# Altium schematic sheet sheet2.SchDoc
size A2
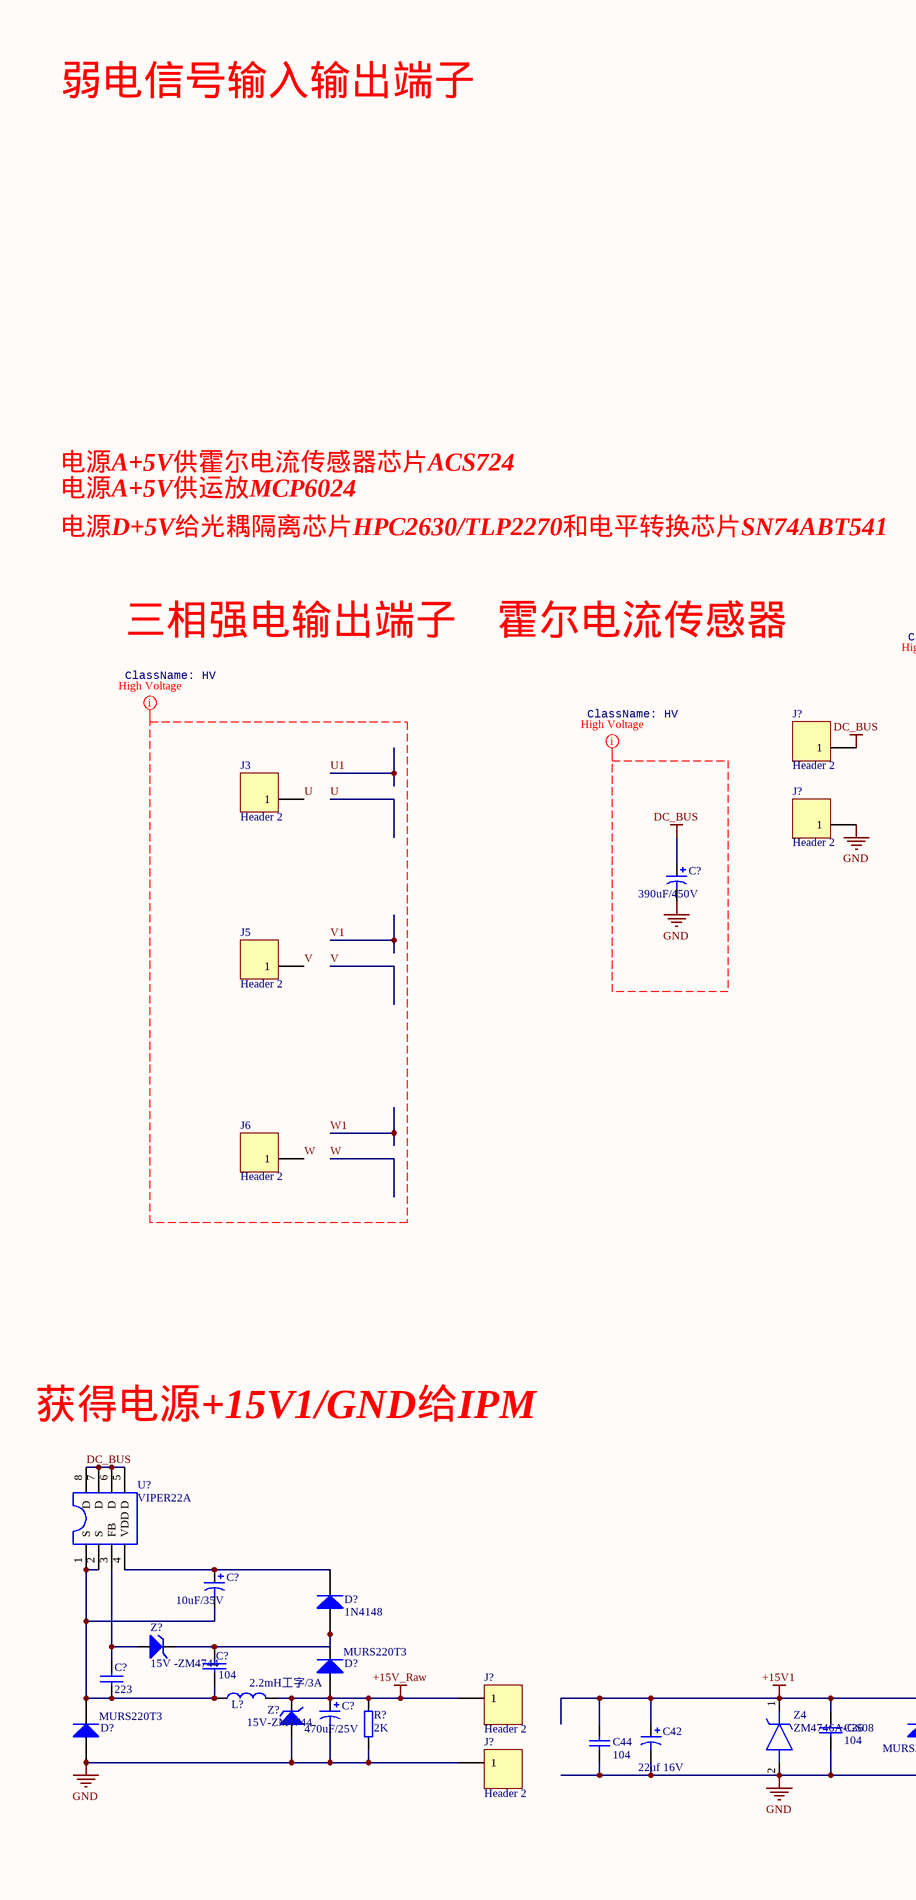
[diagram p0: sheet2.SchDoc, left]
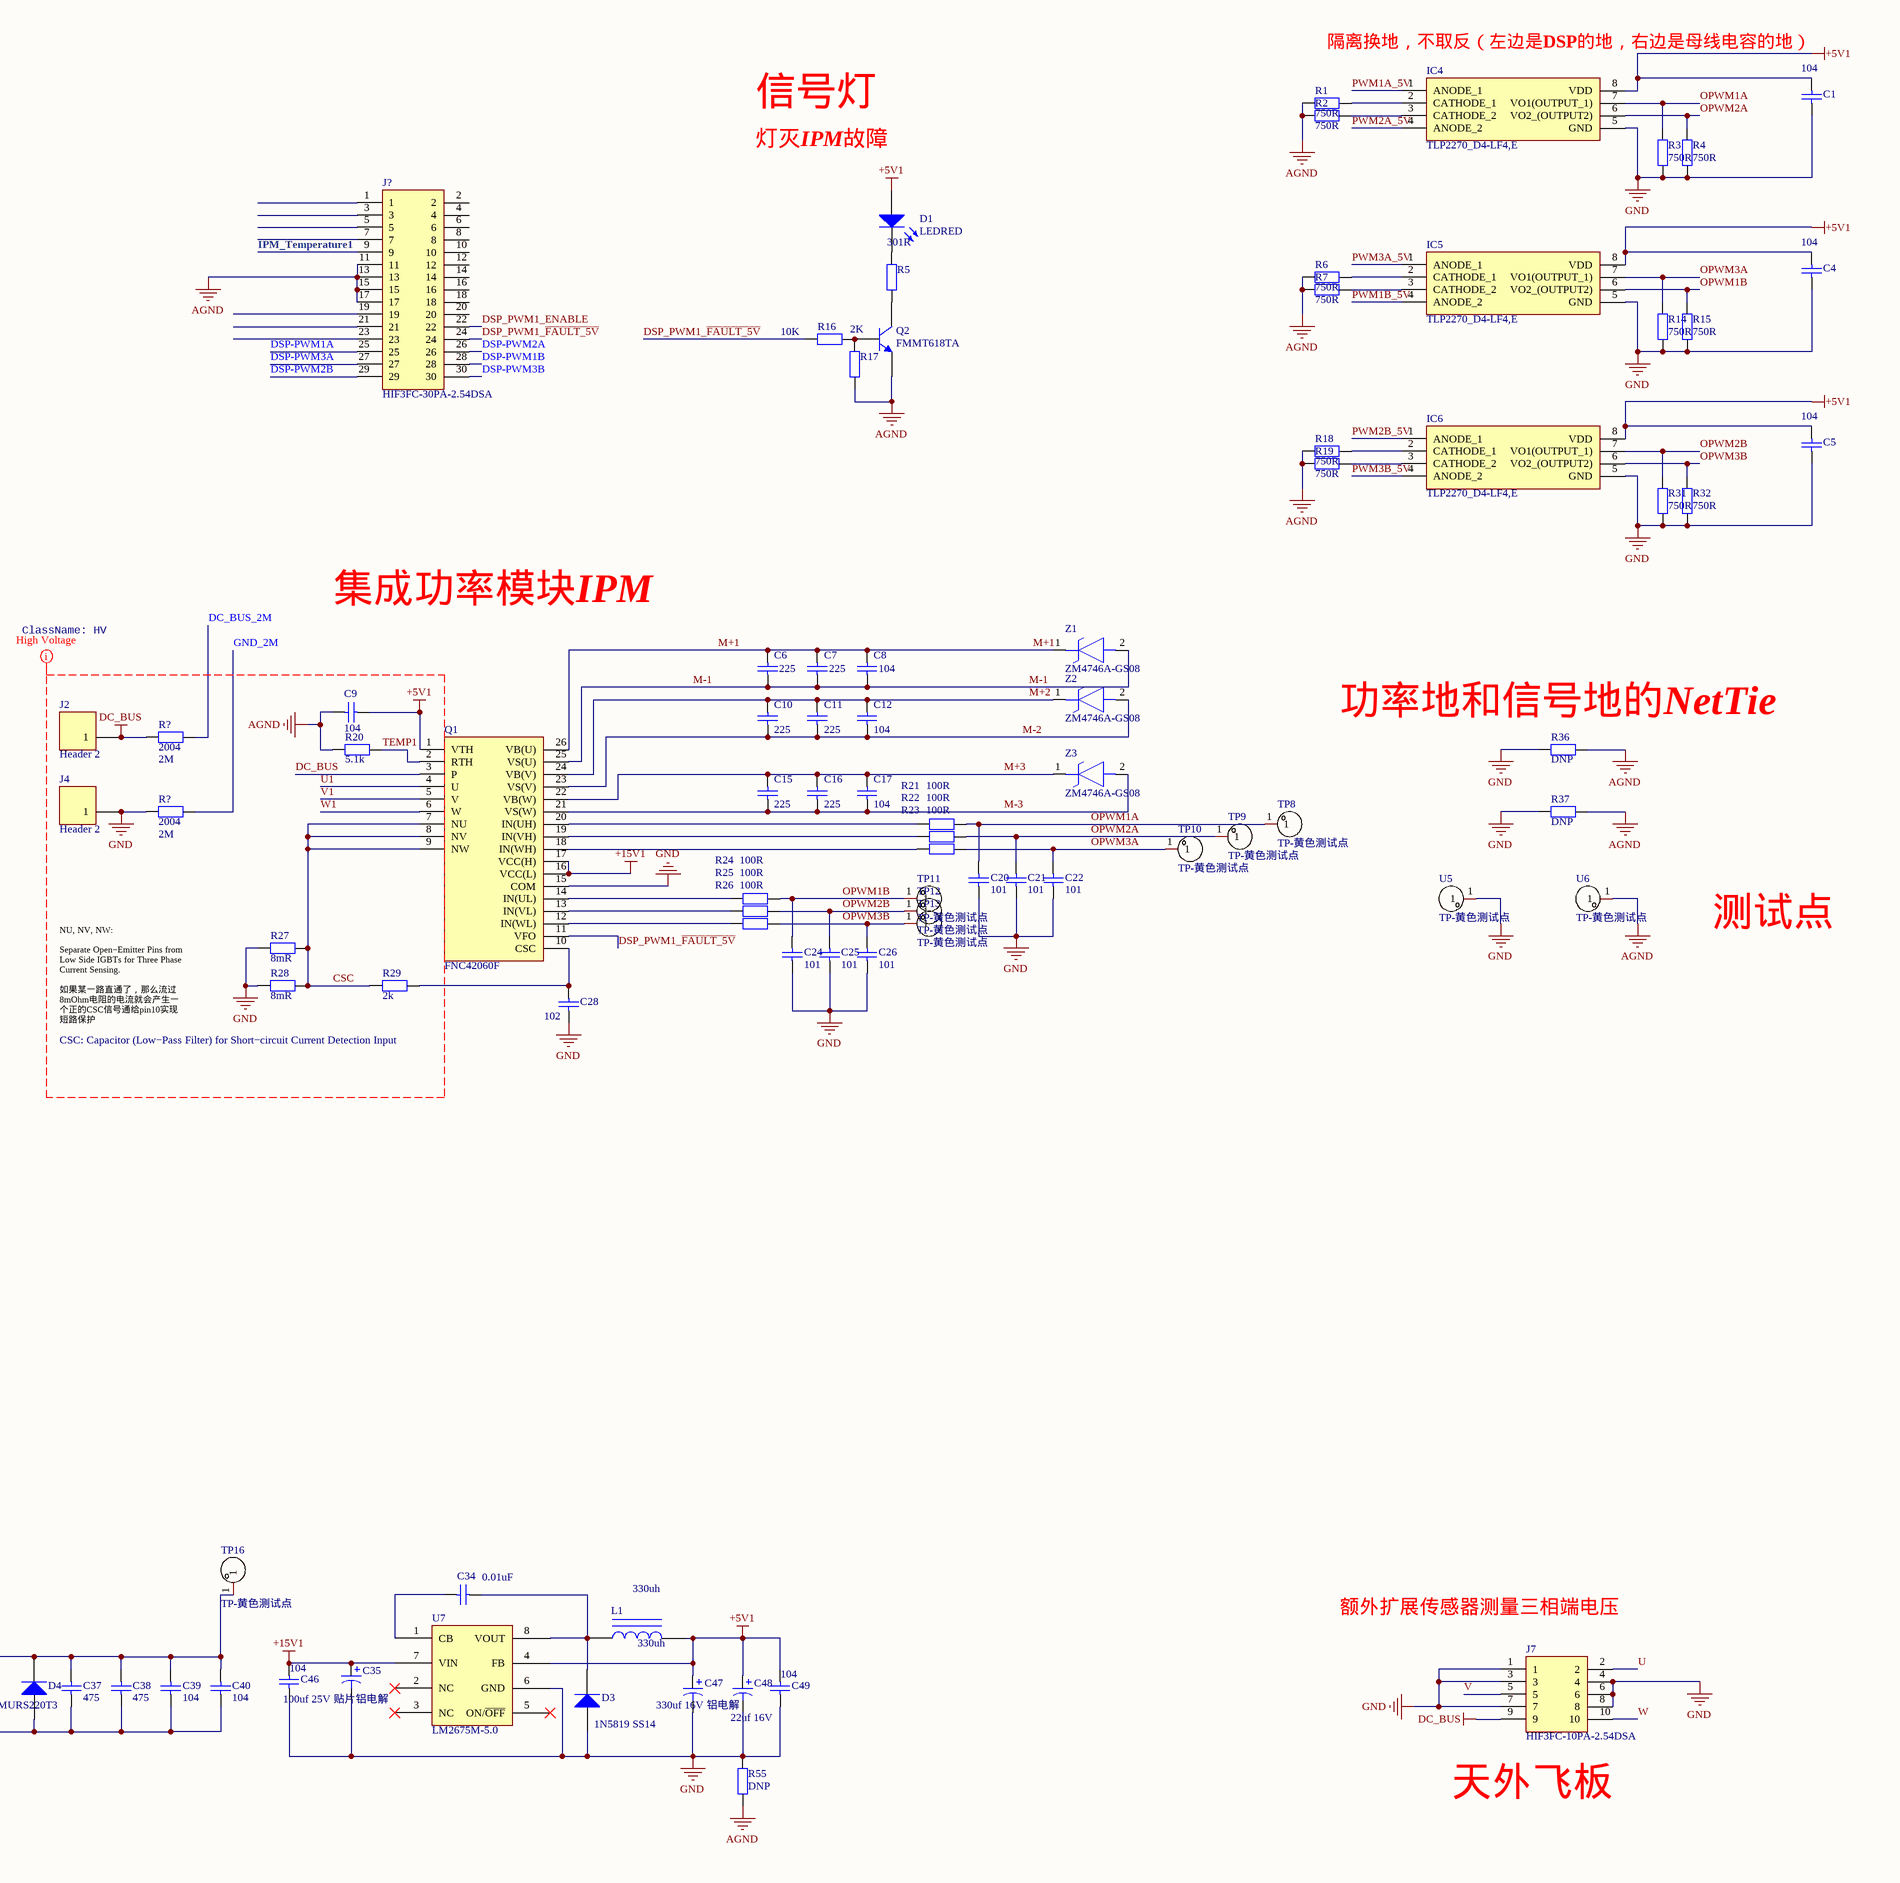
[diagram p1: sheet2.SchDoc, right]

## Parts
(Parts that share a designator on the sheet are numbered #1, #2 ... from top to bottom, then left to right.)
C1  104  [0805]
C4  104  [0805]
C5  104  [0805]
C6  225  [0805]
C7  225  [0805]
C8  104  [0805]
C9  104  [0805]
C10  225  [0805]
C11  225  [0805]
C12  104  [0805]
C15  225  [0805]
C16  225  [0805]
C17  104  [0805]
C20  101  [0805]
C21  101  [0805]
C22  101  [0805]
C24  101  [0805]
C25  101  [0805]
C26  101  [0805]
C28  102  [0805]
C34  0.01uF  [0805]
C35  100uf 25V 贴片铝电解  [CAP/6.4mm -]
C36  104  [0805]
C37  475  [0805]
C38  475  [0805]
C39  104  [0805]
C40  104  [0805]
C42  22uf 16V  [1206 (钽电容)]
C44  104  [0805]
C46  104  [0805]
C47  330uf 16V 铝电解  [CAP/8mm]
C48  22uf 16V  [1206 (钽电容)]
C49  104  [0805]
C?#1  390uF/450V  [CAP/30mm]
C?#2  10uF/35V  [CAP/6.4mm -]
C?#3  104  [0805]
C?#4  223  [0805]
C?#5  470uF/25V  [CAP/8mm]
D1  LEDRED  [L0805]
D3  1N5819 SS14  [DO214AC]
D4  MURS220T3  [DO214AA]
D?#1  1N4148  [LL4148]
D?#2  MURS220T3  [DO214AA]
D?#3  MURS220T3  [DO214AA]
IC4  TLP2270_D4-LF4,E  [SOIC127P1105X220-8N]
IC5  TLP2270_D4-LF4,E  [SOIC127P1105X220-8N]
IC6  TLP2270_D4-LF4,E  [SOIC127P1105X220-8N]
J2  Header 2  [PCB焊接端子]
J3  Header 2  [PCB焊接端子]
J4  Header 2  [PCB焊接端子]
J5  Header 2  [PCB焊接端子]
J6  Header 2  [PCB焊接端子]
J7  HIF3FC-10PA-2.54DSA  [SHDR10W50P254_2X5_2020X850X920P]
J?#1  HIF3FC-30PA-2.54DSA  [SHDR30W50P254_2X15_4560X850X1200P]
J?#2  Header 2  [PCB焊接端子]
J?#3  Header 2  [PCB焊接端子]
J?#4  Header 2  [PCB焊接端子]
J?#5  Header 2  [PCB焊接端子]
L1  330uh  [L_7*7]
L?  2.2mH工字/3A  [L\5\10]
Q1  FNC42060F  [FNC42060F]
Q2  FMMT618TA  [SOT-23]
R1  750R  [0805]
R2  750R  [0805]
R3  750R  [0805]
R4  750R  [0805]
R5  301R  [0805]
R6  750R  [0805]
R7  750R  [0805]
R14  750R  [0805]
R15  750R  [0805]
R16  10K  [0805]
R17  2K  [0805]
R18  750R  [0805]
R19  750R  [0805]
R20  5.1k  [0805]
R21  100R  [0805]
R22  100R  [0805]
R23  100R  [0805]
R24  100R  [0805]
R25  100R  [0805]
R26  100R  [0805]
R27  8mR  [2512]
R28  8mR  [2512]
R29  2k  [0805]
R31  750R  [0805]
R32  750R  [0805]
R36  DNP  [0805]
R37  DNP  [0805]
R55  DNP  [2512]
R?#1  2004  value 2M  [1206]
R?#2  2004  value 2M  [1206]
R?#3  2K  [1206]
TP8  TP-黄色测试点  [TESTPOINT-TH_BD1.0]
TP9  TP-黄色测试点  [TESTPOINT-TH_BD1.0]
TP10  TP-黄色测试点  [TESTPOINT-TH_BD1.0]
TP11  TP-黄色测试点  [TESTPOINT-TH_BD1.0]
TP12  TP-黄色测试点  [TESTPOINT-TH_BD1.0]
TP13  TP-黄色测试点  [TESTPOINT-TH_BD1.0]
TP16  TP-黄色测试点  [TESTPOINT-TH_BD1.0]
U5  TP-黄色测试点  [TESTPOINT-TH_BD1.0]
U6  TP-黄色测试点  [TESTPOINT-TH_BD1.0]
U7  LM2675M-5.0  [SOIC-8]
U?  VIPER22A  [DIP8]
Z1  ZM4746A-GS08  [MELF_DO-213AB]
Z2  ZM4746A-GS08  [MELF_DO-213AB]
Z3  ZM4746A-GS08  [MELF_DO-213AB]
Z4  ZM4746A-GS08  [MELF_DO-213AB]
Z?#1  15V -ZM4744  [LL4148]
Z?#2  15V-ZM4744  [LL4148]

## Nets
+5V1: C1.2 C4.2 C5.2 C9.2 C47.1 C48.1 C49.2 D1.1(A) IC4.8(VDD) IC5.8(VDD) IC6.8(VDD) L1.2 Q1.1(VTH) U7.4(FB)
+15V1: C35.1 C36.1 C37.2 C38.2 C39.2 C40.2 C42.1 C44.1 C46.2 D4.2(K) Q1.16(VCC(L)) Q1.17(VCC(H)) TP16.1 U7.7(VIN) Z4.1(K)
+15V_Raw: C?#5.1 D?#2.1(A) J?#4.1 L?.2 R?#3.1 Z?#2.2(K)
AGND: C9.1 J?#1.11 J?#1.13 J?#1.15 J?#1.17 Q2.2(E) R1.2 R2.2 R6.2 R7.2 R17.2 R18.2 R19.2 R20.1 R36.2 R37.2 R55.1 U6.1
DC_BUS: C?#1.1 J2.1 J7.9 J?#2.1 Q1.3(P) R?#1.1 U?.5(D) U?.6(D) U?.7(D) U?.8(D)
GND: C1.1 C4.1 C5.1 C20.1 C21.1 C22.1 C24.1 C25.1 C26.1 C28.1 C35.2 C36.2 C37.1 C38.1 C39.1 C40.1 C42.2 C44.2 C46.1 C47.2 C48.2 C49.1 C?#1.2 C?#5.2 D3.1 D4.1(A) D?#3.1(A) IC4.5(GND) IC5.5(GND) IC6.5(GND) J4.1 J7.1 J7.3 J7.4 J7.6 J7.7 J7.8 J?#3.1 J?#5.1 Q1.15(COM) R3.2 R4.2 R14.2 R15.2 R27.2 R28.2 R31.2 R32.2 R36.1 R37.1 R55.2 R?#2.1 R?#3.2 U5.1 U7.6(GND) Z4.2(A) Z?#2.1(A)
CSC: Q1.7(NU) Q1.8(NV) Q1.9(NW) R27.1 R28.1 R29.2
DC_BUS_2M: R?#1.2
DSP-PWM1A: J?#1.25
DSP-PWM1B: J?#1.28
DSP-PWM2A: J?#1.26
DSP-PWM2B: J?#1.29
DSP-PWM3A: J?#1.27
DSP-PWM3B: J?#1.30
DSP_PWM1_ENABLE: J?#1.22
DSP_PWM1_~{FAULT_5V}: J?#1.24 Q1.11(VFO) R16.2
GND_2M: R?#2.2
IPM_Temperature1: J?#1.9
M+1: C6.1 C7.1 C8.1 Q1.26(VB(U)) Z1.1(K)
M+2: C10.1 C11.1 C12.1 Q1.24(VB(V)) Z2.1(K)
M+3: C15.1 C16.1 C17.1 Q1.22(VB(W)) Z3.1(K)
M-1: C6.2 C7.2 C8.2 Q1.25(VS(U)) Z1.2(A)
M-2: C10.2 C11.2 C12.2 Q1.23(VS(V)) Z2.2(A)
M-3: C15.2 C16.2 C17.2 Q1.21(VS(W)) Z3.2(A)
OPWM1A: C20.2 IC4.7(VO1(OUTPUT_1)) R3.1 R21.2 TP8.1
OPWM1B: C24.2 IC5.6(VO2_(OUTPUT2)) R15.1 R24.2 TP11.1
OPWM2A: C21.2 IC4.6(VO2_(OUTPUT2)) R4.1 R22.2 TP9.1
OPWM2B: C25.2 IC6.7(VO1(OUTPUT_1)) R25.2 R31.1 TP12.1
OPWM3A: C22.2 IC5.7(VO1(OUTPUT_1)) R14.1 R23.2 TP10.1
OPWM3B: C26.2 IC6.6(VO2_(OUTPUT2)) R26.2 R32.1 TP13.1
PWM1A_5V: IC4.1(ANODE_1)
PWM1B_5V: IC5.4(ANODE_2)
PWM2A_5V: IC4.4(ANODE_2)
PWM2B_5V: IC6.1(ANODE_1)
PWM3A_5V: IC5.1(ANODE_1)
PWM3B_5V: IC6.4(ANODE_2)
TEMP1: Q1.2(RTH) R20.2
U: J3.1 J7.2
U1: Q1.4(U)
V: J5.1 J7.5
V1: Q1.5(V)
W: J6.1 J7.10
W1: Q1.6(W)
NetC28_2: C28.2 Q1.10(CSC) R29.1
NetC34_1: C34.1 D3.2 L1.1 U7.8(VOUT)
NetC34_2: C34.2 U7.1(CB)
NetC?#2_1: C?#2.1 D?#1.2(K) U?.4(VDD)
NetC?#2_2: C?#2.2 C?#3.1 C?#4.1 D?#3.2(K) L?.1 U?.1(S) U?.2(S)
NetC?#3_2: C?#3.2 D?#1.1(A) D?#2.2(K) Z?#1.2(K)
NetC?#4_2: C?#4.2 U?.3(FB) Z?#1.1(A)
NetD1_2: D1.2(K) R5.2
NetIC4_2: IC4.2(CATHODE_1) R1.1
NetIC4_3: IC4.3(CATHODE_2) R2.1
NetIC5_2: IC5.2(CATHODE_1) R6.1
NetIC5_3: IC5.3(CATHODE_2) R7.1
NetIC6_2: IC6.2(CATHODE_1) R18.1
NetIC6_3: IC6.3(CATHODE_2) R19.1
NetQ1_12: Q1.12(IN(WL)) R26.1
NetQ1_13: Q1.13(IN(VL)) R25.1
NetQ1_14: Q1.14(IN(UL)) R24.1
NetQ1_18: Q1.18(IN(WH)) R23.1
NetQ1_19: Q1.19(IN(VH)) R22.1
NetQ1_20: Q1.20(IN(UH)) R21.1
NetQ2_1: Q2.1(B) R16.1 R17.1
NetQ2_3: Q2.3(C) R5.1

Not connected (* = marked no-connect by the designer): J?#1 1 2 3 4 5 6 7 8 10 12 14 16 18 19 20 21 23; U7 2(NC)* 3(NC)* 5(ON/~{OFF})*

## Layout directives
net class HV: +5V1, AGND, CSC, DC_BUS, GND, TEMP1, U, U1, V, V1, W, W1

## Notes on the sheet
- 隔离换地，不取反（左边是DSP的地，右边是母线电容的地）
- 弱电信号输入输出端子
- 灯灭IPM故障
- 信号灯
- 电源A+5V供霍尔电流传感器芯片ACS724
- 电源A+5V供运放MCP6024
- 电源D+5V给光耦隔离芯片HPC2630/TLP2270和电平转换芯片SN74ABT541
- 三相强电输出端子
- 霍尔电流传感器
- 集成功率模块IPM
- (near R36) 功率地和信号地的NetTie
- 测试点
- NU, NV, NW:
  Separate Open−Emitter Pins from Low Side IGBTs for Three Phase Current Sensing.
  如果某一路直通了，那么流过8mOhm电阻的电流就会产生一个正的CSC信号通给pin10实现短路保护
- CSC: Capacitor (Low−Pass Filter) for Short−circuit Current Detection Input
- 获得电源+15V1/GND给IPM
- 额外扩展传感器测量三相端电压
- (near J7) 天外飞板

## Library data of the parts
C1 C4-C12 C15-C17 C20-C22 C24-C26 C28 C34 C37-C40 = Cap: Capacitor
  C1 C4 C5: Published: 8-Jun-2000; Revision: July-2002: Re-released for DXP Platform.; Publisher: Altium Limited
  C6-C12 C15-C17 C20-C22 C24-C26 C28 C37-C40: Published: *; LatestRevisionDate: *; LatestRevisionNote: *; PackageReference: *; Publisher: *
  C34: Published: 8-Jun-2000; Revision: July-2002: Re-released for DXP Platform.; Publisher: Altium Limited; Value: 0.01uF
C35 C42 C47 C48 C?#1 C?#2 C?#5 = Cap Pol1: Polarized Capacitor (Radial); Published: 8-Jun-2000; LatestRevisionDate: 17-Jul-2002; LatestRevisionNote: Re-released for DXP Platform.; Publisher: Altium Limited
C36 C?#3 C?#4 = CAP: Capacitor
C44 = Cap: Capacitor; Value: 0.1UF; Published: 8-Jun-2000; LatestRevisionDate: 17-Jul-2002; LatestRevisionNote: Re-released for DXP Platform.; PackageReference: RAD-0.3; Publisher: Altium Limited
C46 C49 = Cap Semi: Capacitor (Semiconductor SIM Model); Published: 8-Jun-2000; LatestRevisionDate: 17-Jul-2002; LatestRevisionNote: Re-released for DXP Platform.; PackageReference: C1206; Publisher: Altium Limited
D1 = LED0: Typical INFRARED GaAs LED; Published: 8-Jun-2000; LatestRevisionDate: 08-Jul-2005; LatestRevisionNote: Mech Layer 1 removed.; PackageReference: LED-0; Publisher: Altium Limited; PackageDescription: LED; 2 Leads; ClassName: HelloDSP
D3 D4 D?#2 D?#3 = Diode 1N5408: 3 Amp Medium Power Silicon Rectifier Diode; Published: 8-Jun-2000; LatestRevisionDate: 17-Jul-2002; LatestRevisionNote: Re-released for DXP Platform.; DatasheetDocument: Aug-1984; PackageReference: DO-201AD; Publisher: Altium Limited; ComponentLink1Description: Manufacturer Link; ComponentLink1URL: http://www.irf.com/
D?#1 = Diode 1N4148: High Conductance Fast Diode; Published: 8-Jun-2000; LatestRevisionDate: 17-Jul-2002; LatestRevisionNote: Re-released for DXP Platform.; DatasheetDocument: 1997; PackageReference: DO-35; Publisher: Altium Limited; Code_JEDEC: DO-204-AH; ComponentLink1Description: Manufacturer Link; ComponentLink1URL: http://www.fairchildsemi.com/; ComponentLink2Description: Datasheet; ComponentLink2URL: http://www.fairchildsemi.com/ds/1N%2F1N4148.pdf
IC4-IC6 = TLP2270_D4-LF4,E: Integrated Circuit; Manufacturer_Name: Toshiba; Manufacturer_Part_Number: TLP2270(D4-LF4,E; Datasheet Link: http://toshiba.semicon-storage.com/info/docget.jsp?did=54624&prodName=TLP2270; Height: 2.2mm; Mouser Part Number: 757-TLP2270D4-LF4E; Mouser Price/Stock: https://www.mouser.co.uk/ProductDetail/Toshiba/TLP2270D4-LF4E?qs=byeeYqUIh0MHPEM80CcHUQ%3D%3D; Arrow Part Number: TLP2270(D4-LF4,E; Arrow Price/Stock: https://www.arrow.com/en/products/tlp2270-d4-lf4e/toshiba
J2-J6 J?#2-J?#5 = Header 2: Header, 2-Pin; LatestRevisionDate: 17-Jul-2002; LatestRevisionNote: Re-released for DXP Platform.; Publisher: Altium Limited
J7 = HIF3FC-10PA-2.54DSA: Connector; Manufacturer_Name: Hirose; Manufacturer_Part_Number: HIF3FC-10PA-2.54DSA(71); Datasheet Link: https://componentsearchengine.com/Datasheets/1/HIF3FC-10PA-2.54DSA(71).pdf; Height: 9.2mm; Mouser Part Number: 798-HIF3FC10PA254D71; Mouser Price/Stock: https://www.mouser.co.uk/ProductDetail/Hirose-Connector/HIF3FC-10PA-2.54DSA71?qs=eDUdFcBPps26f2LJxn%252B8VA%3D%3D; System: Connector
J?#1 = HIF3FC-30PA-2.54DSA: Connector; Manufacturer_Name: Hirose; Manufacturer_Part_Number: HIF3FC-30PA-2.54DSA(71); Datasheet Link: https://datasheet.datasheetarchive.com/originals/distributors/SFDatasheet-7/sf-000141320.pdf; Height: 12mm; Mouser Part Number: 798-HIF3FC30PA254D71; Mouser Price/Stock: https://www.mouser.co.uk/ProductDetail/Hirose-Connector/HIF3FC-30PA-254DSA71?qs=eDUdFcBPps32%2FyAdBVx6ww%3D%3D; System: Connector
L1 = Inductor Iron: Magnetic-Core Inductor; Published: 24-Mar-1999; LatestRevisionDate: 17-Jul-2002; LatestRevisionNote: Re-released for DXP Platform.; PackageReference: AXIAL-0.9; Publisher: Altium Limited; Value: 330uh
L? = INDUCTOR1: INDUCTOR
Q1 = FNC42060F: Transistor IGBT; Manufacturer_Name: Aptina / ON Semiconductor; Datasheet Link: https://www.onsemi.com/pdf/datasheet/fnc42060f2-d.pdf; Height: 4.8mm; Manufacturer_Part_Number: FNC42060F; Mouser Part Number: 512-FNC42060F; Mouser Price/Stock: https://www.mouser.co.uk/ProductDetail/onsemi-Fairchild/FNC42060F?qs=udYk%2FVsBYxunyypMBLcvag%3D%3D
Q2 = NPN: NPN Bipolar Transistor; Published: 8-Jun-2000; LatestRevisionDate: 17-Jul-2002; LatestRevisionNote: Re-released for DXP Platform.; PackageReference: TO-226-AA; Publisher: Altium Limited; PackageDescription: TO, Flat Index; 3 In-Line, Axial Leads; Body Dia. 4.8mm; Leads 0.55 x 0.51 mm (max); Code_JEDEC: TO-226-AA; ClassName: HelloDSP
R1-R4 R6 R7 R14-R26 R29 R31 R32 R36 R37 R55 R?#1 R?#2 = Res2: Resistor
  R1-R4 R6 R7 R14 R15 R18 R19 R31 R32: Published: 8-Jun-2000; LatestRevisionDate: 17-Jul-2002; LatestRevisionNote: Re-released for DXP Platform.; Publisher: Altium Limited
  R16: Published: 8-Jun-2000; LatestRevisionDate: 17-Jul-2002; LatestRevisionNote: Re-released for DXP Platform.; PackageReference: AXIAL-0.4; Publisher: Altium Limited; Value: 10K; ClassName: HelloDSP
  R17: Published: 8-Jun-2000; LatestRevisionDate: 17-Jul-2002; LatestRevisionNote: Re-released for DXP Platform.; PackageReference: AXIAL-0.4; Publisher: Altium Limited; Value: 2K; ClassName: HelloDSP
  R20 R29 R36 R37 R?#1 R?#2: Published: 8-Jun-2000; LatestRevisionDate: 17-Jul-2002; LatestRevisionNote: Re-released for DXP Platform.; PackageReference: AXIAL-0.4; Publisher: Altium Limited
  R21-R26: Published: *; LatestRevisionDate: *; LatestRevisionNote: *; PackageReference: *; Publisher: *
  R55: Published: 8-Jun-2000; LatestRevisionDate: 17-Jul-2002; LatestRevisionNote: Re-released for DXP Platform.; PackageReference: AXIAL-0.4; Publisher: Altium Limited; ClassName: Power
R5 = Res2: Resistor; Value: 300R; Published: 8-Jun-2000; LatestRevisionDate: 17-Jul-2002; LatestRevisionNote: Re-released for DXP Platform.; PackageReference: AXIAL-0.4; Publisher: Altium Limited; ClassName: HelloDSP
R27 R28 = Res2: Resistor; Value: 3.3K; Published: 8-Jun-2000; LatestRevisionDate: 17-Jul-2002; LatestRevisionNote: Re-released for DXP Platform.; PackageReference: AXIAL-0.4; Publisher: Altium Limited; PackageDescription: Axial Device, Thru-Hole; 2 Leads; 0.4 in Pin Spacing
R?#3 = RES
TP8-TP13 TP16 U5 U6 = TP-黄色测试点: Add into BOM: yes; Name: TP-黄色测试点; Symbol: TP-黄色测试点; Device: TP-黄色测试点; LCSC Part Name: TP-黄色测试点; Supplier Part: C9900007422; Manufacturer Part: TP-黄色测试点; Supplier Footprint: TESTPOINT-TH_BD-2P-P2.00; JLCPCB Part Class: Extended Part; Datasheet: https://atta.szlcsc.comnull; Supplier: LCSC; Convert to PCB: yes
U7 = LM2675
U? = IC/VIPER12
Z1-Z4 = ZM4746A-GS08: Zener Diode; Manufacturer_Name: Vishay; Datasheet Link: https://www.vishay.com/docs/85786/zm4728a.pdf; Manufacturer_Part_Number: ZM4746A-GS08; Mouser Part Number: 625-ZM4746A; Mouser Price/Stock: https://www.mouser.co.uk/ProductDetail/Vishay-Semiconductors/ZM4746A-GS08?qs=oNDV51lhjEMLl7Fqtt9WtQ%3D%3D; Arrow Part Number: ZM4746A-GS08; Arrow Price/Stock: https://www.arrow.com/en/products/zm4746a-gs08/vishay?region=nac
Z?#1 Z?#2 = ZENER: Zener Diode